# EAGLE schematic senseye-2 (EAGLE 6.5.0)
AUTHOR: Neal Jackson; REV: A; TITLE: SensEye-2
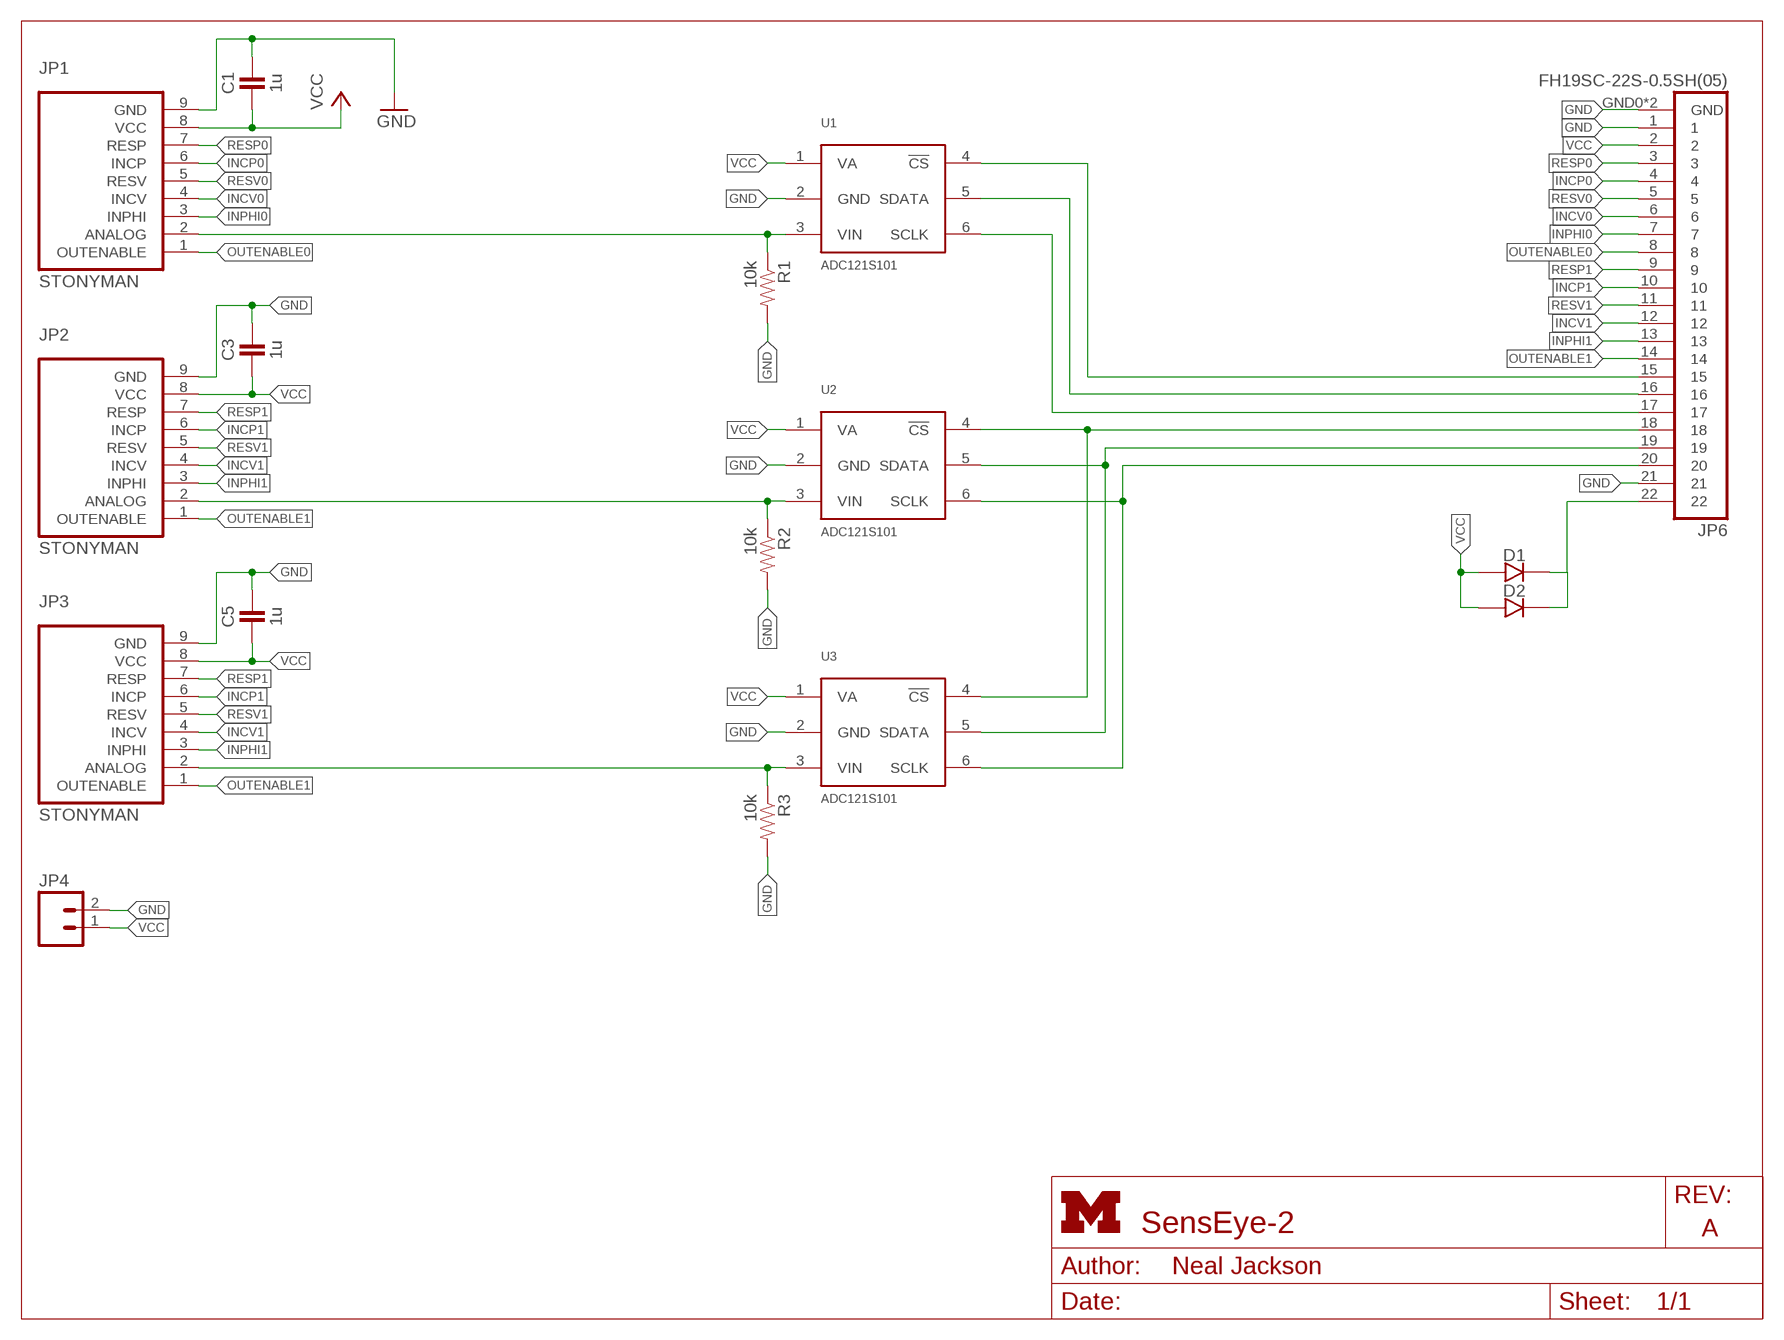
[diagram p0: schematic, sheet 1]
FRAME1 (LETTER_L): HEIGHT: 8.5in; WIDTH: 11in

## Parts
C1  1u  CAPACITOR  [0402_CAP]
C3  1u  CAPACITOR  [0402_CAP]
C5  1u  CAPACITOR  [0402_CAP]
D1  DIODE0603  [0603-DIODE]
D2  DIODE0603  [0603-DIODE]
JP1  STONYMAN  [1X09]
JP2  STONYMAN  [1X09]
JP3  STONYMAN  [1X09]
JP4  M02PTH  [1X02]
JP6  FH19SC-22S-0.5SH(05)  [FH19SC-22S-0.5SH(05)]
R1  10k  RESISTOR0402_RES  [0402_RES]
R2  10k  RESISTOR0402_RES  [0402_RES]
R3  10k  RESISTOR0402_RES  [0402_RES]
U1  ADC121S101  [SOT-23-6]
U2  ADC121S101  [SOT-23-6]
U3  ADC121S101  [SOT-23-6]

## Nets
!CS0: JP6.15 U1.4(!CS)
ANALOG0: JP1.2(ANALOG) R1.1 U1.3(VIN)
GND: C1.1 C3.1 C5.1 JP1.9(GND) JP2.9(GND) JP3.9(GND) JP4.2 JP6.1 JP6.21 JP6.GND0(GND) JP6.GND1(GND) R1.2 R2.2 R3.2 U1.2(GND) U2.2(GND) U3.2(GND)
INCP0: JP1.6(INCP) JP6.4
INCP1: JP2.6(INCP) JP3.6(INCP) JP6.10
INCV0: JP1.4(INCV) JP6.6
INCV1: JP2.4(INCV) JP3.4(INCV) JP6.12
INPHI0: JP1.3(INPHI) JP6.7
INPHI1: JP2.3(INPHI) JP3.3(INPHI) JP6.13
LED: D1.2(CATHODE) D2.2(CATHODE) JP6.22
N$1: JP2.2(ANALOG) R2.1 U2.3(VIN)
N$3: JP3.2(ANALOG) R3.1 U3.3(VIN)
N$6: JP6.18 U2.4(!CS) U3.4(!CS)
OUTENABLE0: JP1.1(OUTENABLE) JP6.8
OUTENABLE1: JP2.1(OUTENABLE) JP3.1(OUTENABLE) JP6.14
RESP0: JP1.7(RESP) JP6.3
RESP1: JP2.7(RESP) JP3.7(RESP) JP6.9
RESV0: JP1.5(RESV) JP6.5
RESV1: JP2.5(RESV) JP3.5(RESV) JP6.11
SCLK0: JP6.17 U1.6(SCLK)
SCLK1: JP6.20 U2.6(SCLK) U3.6(SCLK)
SDATA0: JP6.16 U1.5(SDATA)
SDATA1: JP6.19 U2.5(SDATA) U3.5(SDATA)
VCC: C1.2 C3.2 C5.2 D1.1(ANODE) D2.1(ANODE) JP1.8(VCC) JP2.8(VCC) JP3.8(VCC) JP4.1 JP6.2 U1.1(VA) U2.1(VA) U3.1(VA)

## Library data of the parts
C1 C3 C5 = passives:CAPACITOR: 0402 Capacitor
D1 D2 = passives:DIODE
JP1-JP3 = senseye:STONYMAN: Header 9 Standard 9-pin 0.1" header. Use with straight break away headers (SKU : PRT-00116), right angle break away headers (PRT-00553), swiss pins (PRT-00743), machine pins (PRT-00117), and female headers (PRT-00115).
JP4 = SparkFun-Connectors:M02: Header 2 Standard 2-pin 0.1" header. Use with straight break away headers (SKU : PRT-00116), right angle break away headers (PRT-00553), swiss pins (PRT-00743), machine pins (PRT-00117), and female headers (PRT-00115). Molex polarized connector foot print use with SKU : PRT-08233 with associated crimp pins and housings.
JP6 = senseye:FH19SC-22S-0.5SH(05)
R1-R3 = passives:RESISTOR: Resistor Basic schematic elements and footprints for 0603, 1206, and PTH resistors.
U1-U3 = chips:ADC121S101: Analogue to Digital Converter, 12 bit, 1 MSPS, Single, 2.7 V, 5.25 V, SOT-23; DIGIKEY: ADC121S101CIMF/NOPBCT-ND; MOUSER: 926-AD121S101CISDNPB; NEWARK: 96K6188